# EAGLE design board (EAGLE 7.3.0)
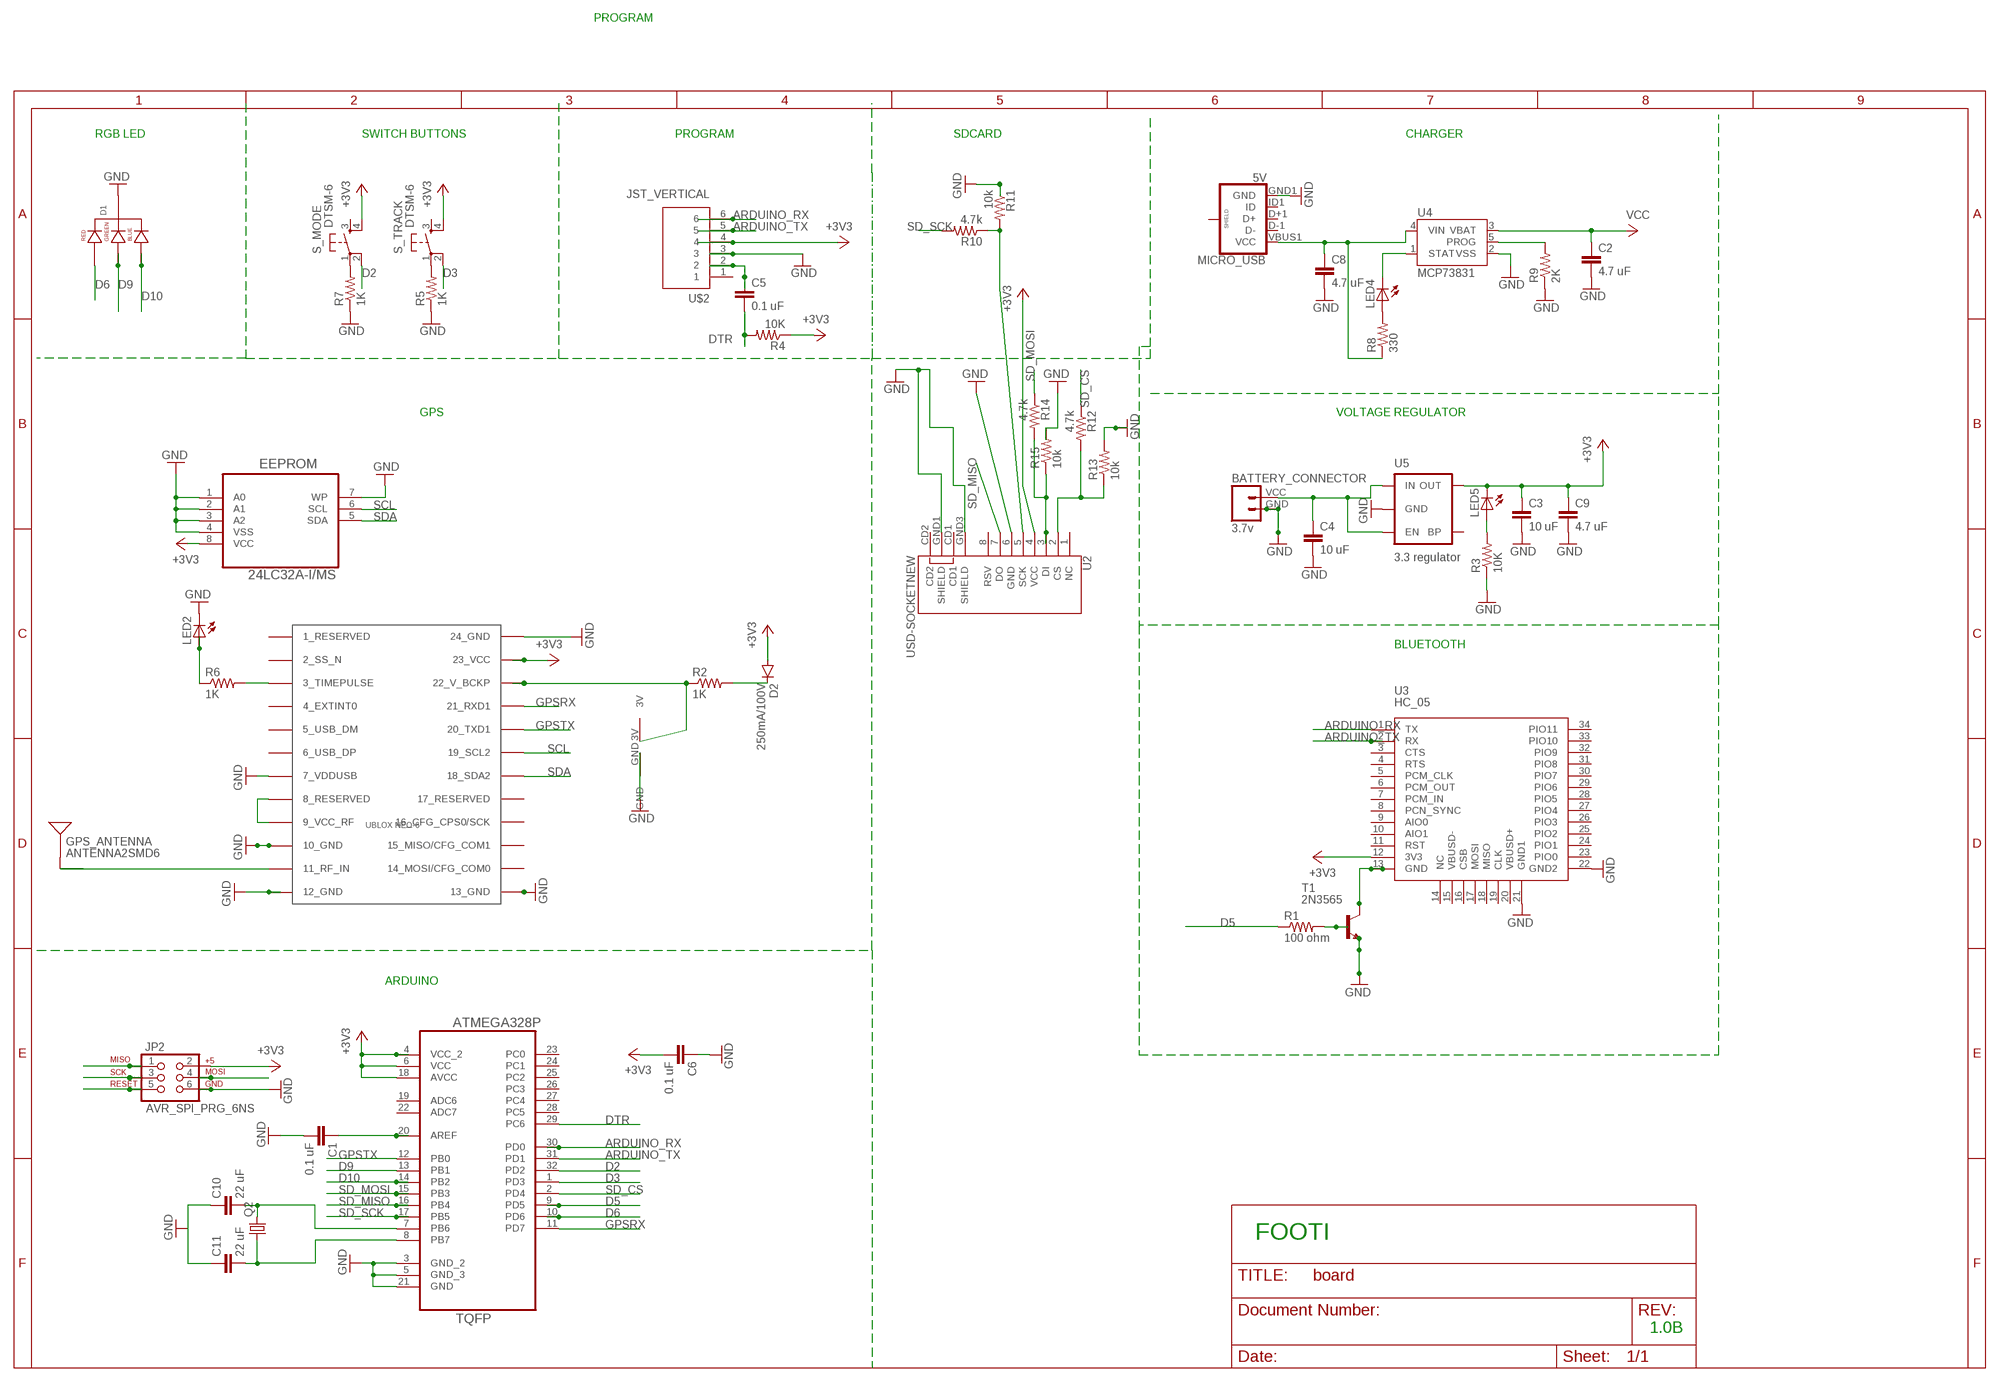
[diagram p0: schematic, sheet 1]

## Parts
BATTERY_CONNECTOR  3.7v  M024UCON-15767  [JST-2-SMD-VERT]
C1  0.1 uF  CAP1206  [1206]
C2  4.7 uF  CAP1206  [1206]
C3  10 uF  CAP1206  [1206]
C4  10 uF  CAP1206  [1206]
C5  0.1 uF  CAP1206  [1206]
C6  0.1 uF  CAP1206  [1206]
C8  4.7 uF  CAP1206  [1206]
C9  4.7 uF  CAP1206  [1206]
C10  22 uF  CAP1206  [1206]
C11  22 uF  CAP1206  [1206]
D1  LED-RGB-CC-THRUCLEAR  [LED-RGB-THRU]
D2  250mA/100V  DIODEBAS16  [SOD-323]
EEPROM  24LC32A-I/MS  [SOP65P490X110-8N]
GPS_ANTENNA  ANTENNA2SMD6  [ANTENNA-CHIP6]
JP2  AVR_SPI_PRG_6NS  [2X3-NS]
LED2  LED_E  [LED_1206]
LED4  LED_E  [LED_1206]
LED5  LED_E  [LED_1206]
MICRO_USB  5V  USB_MICROB_PLUGCONN-11752  [USB-B-MICRO-SMD_V03]
Q2  CRYSTALCTS406  [CTS406]
R1  100 ohm  RESISTOR1206  [1206]
R2  1K  RESISTOR1206  [1206]
R3  10K  RESISTOR1206  [1206]
R4  10K  RESISTOR1206  [1206]
R5  1K  RESISTOR1206  [1206]
R6  1K  RESISTOR1206  [1206]
R7  1K  RESISTOR1206  [1206]
R8  330  RESISTOR1206  [1206]
R9  2K  RESISTOR1206  [1206]
R10  4.7k  RESISTOR1206  [1206]
R11  10k  RESISTOR1206  [1206]
R12  4.7k  RESISTOR1206  [1206]
R13  10k  RESISTOR1206  [1206]
R14  4.7k  RESISTOR1206  [1206]
R15  10k  RESISTOR1206  [1206]
S_MODE  DTSM-6  [DTSM-6]
S_TRACK  DTSM-6  [DTSM-6]
T1  2N3565  [TO92]
U2  USD-SOCKETNEW  [MICRO-SD-SOCKET-PP]
U3  HC_05  [BLUETOOTH_SMD]
U4  MCP73831  [SOT23-5]
U5  3.3 regulator  MIC52053.3V  [SOT23-5]
U6  ATMEGA328P-AU  [QFP80P900X900X120-32N]
U$1  UBLOX_NEO-6  [UBLOX_NEO-6P]
U$2  JST_VERTICAL  [JST-6-SMD-VERT-1.0MM]
U$4  VL1220/HFN  VL1220  [VL1220]

## Nets
+3V3: C3.1 C6.2 C9.1 D2.A EEPROM.8(VCC) JP2.2 LED5.C R4.1 S_MODE.4 S_TRACK.4 U2.4(VCC) U3.12(3V3) U5.5(OUT) U6.4(VCC_2) U6.6(VCC) U6.18(AVCC) U$1.23_VCC U$2.4
ARDUINO_RX: U3.1(TX) U6.30(PD0) U$2.6
ARDUINO_TX: U3.2(RX) U6.31(PD1) U$2.5
D2: S_MODE.2 U6.32(PD2)
D3: S_TRACK.2 U6.1(PD3)
D5: R1.1 U6.9(PD5)
D6: D1.1(RED_CATHODE) U6.10(PD6)
D9: D1.3(GREEN_CATHODE) U6.13(PB1)
D10: D1.4(BLUE_CATHODE) U6.14(PB2)
DTR: C5.2 JP2.5 R4.2 U6.29(PC6)
GND [ground]: BATTERY_CONNECTOR.GND C1.2 C2.2 C3.2 C4.2 C6.1 C8.2 C9.2 C10.1 C11.1 D1.2(CATHODE) EEPROM.1(A0) EEPROM.2(A1) EEPROM.3(A2) EEPROM.4(VSS) EEPROM.7(WP) JP2.6 LED2.C MICRO_USB.GND1(GND) R3.1 R5.1 R7.1 R9.1 R11.1 R13.2 R15.2 T1.3(E) U2.6(GND) U2.GND1(SHIELD) U2.GND3(SHIELD) U3.21(GND1) U3.22(GND2) U4.2(VSS) U5.2(GND) U6.3(GND_2) U6.5(GND_3) U6.21(GND) U$1.7_VDDUSB U$1.10_GND U$1.12_GND U$1.13_GND U$1.24_GND U$2.3 U$4.GND
GPSRX: U6.11(PD7) U$1.21_RXD1
GPSTX: U6.12(PB0) U$1.20_TXD1
N$1: D2.C R2.2
N$2: C8.1 MICRO_USB.VBUS1(VCC) R8.1 U4.4(VIN)
N$3: R6.2 U$1.3_TIMEPULSE
N$4: LED2.A R6.1
N$5: U$1.8_RESERVED U$1.9_VCC_RF
N$6: R2.1 U$1.22_V_BCKP U$4.3V
N$7: GPS_ANTENNA.1(SIGNAL) U$1.11_RF_IN
N$8: LED4.A R8.2
N$9: R7.2 S_MODE.1
N$10: R5.2 S_TRACK.1
N$11: LED4.C U4.1(STAT)
N$13: C5.1 U$2.2
N$14: R10.1 R11.2 U2.5(SCK)
N$15: R9.2 U4.5(PROG)
N$16: LED5.A R3.2
N$17: R12.2 R13.1 U2.2(CS)
N$19: R1.2 T1.2(B)
N$20: T1.1(C) U3.13(GND)
N$22: C1.1 U6.20(AREF)
N$26: R14.2 R15.1 U2.3(DI)
N$27: C11.2 Q2.1 U6.8(PB7)
N$29: C10.2 Q2.3 U6.7(PB6)
SCL: EEPROM.6(SCL) U$1.19_SCL2
SD_CS: R12.1 U6.2(PD4)
SD_MISO: JP2.1 U2.7(DO) U6.16(PB4)
SD_MOSI: JP2.4 R14.1 U6.15(PB3)
SD_SCK: JP2.3 R10.2 U6.17(PB5)
SDA: EEPROM.5(SDA) U$1.18_SDA2
VCC: BATTERY_CONNECTOR.VCC C2.1 C4.1 U4.3(VBAT) U5.1(IN) U5.3(EN)
Unconnected: MICRO_USB.D+1(D+) MICRO_USB.D-1(D-) MICRO_USB.ID1(ID) MICRO_USB.SHIELD1(SHIELD) MICRO_USB.SHIELD2(SHIELD) MICRO_USB.SHIELD3(SHIELD) S_MODE.3 S_TRACK.3 U2.1(NC) U2.8(RSV) U2.CD1 U2.CD2 U3.3(CTS) U3.4(RTS) U3.5(PCM_CLK) U3.6(PCM_OUT) U3.7(PCM_IN) U3.8(PCN_SYNC) U3.9(AIO0) U3.10(AIO1) U3.11(RST) U3.14(NC) U3.15(VBUSD-) U3.16(CSB) U3.17(MOSI) U3.18(MISO) U3.19(CLK) U3.20(VBUSD+) U3.23(PIO0) U3.24(PIO1) U3.25(PIO2) U3.26(PIO3) U3.27(PIO4) U3.28(PIO5) U3.29(PIO6) U3.30(PIO7) U3.31(PIO8) U3.32(PIO9) U3.33(PIO10) U3.34(PIO11) U5.4(BP) U6.19(ADC6) U6.22(ADC7) U6.23(PC0) U6.24(PC1) U6.25(PC2) U6.26(PC3) U6.27(PC4) U6.28(PC5) U$1.1_RESERVED U$1.2_SS_N U$1.4_EXTINT0 U$1.5_USB_DM U$1.6_USB_DP U$1.14_MOSI/CFG_COM0 U$1.15_MISO/CFG_COM1 U$1.16_CFG_CPS0/SCK U$1.17_RESERVED U$2.1

## Notes on the sheet
- PROGRAM
- RGB LED | SWITCH BUTTONS | PROGRAM | SDCARD | CHARGER
- GPS | VOLTAGE REGULATOR
- BLUETOOTH
- ARDUINO
- FOOTI
- 1.0B

## Library data of the parts
BATTERY_CONNECTOR = SparkFun-Connectors:M02: Standard 2-pin 0.1" header. Use with - straight break away headers ( PRT-00116) - right angle break away headers (PRT-00553) - swiss pins (PRT-00743) - machine pins (PRT-00117) - female headers (PRT-00115) Molex polarized connector foot print use with: PRT-08233 with associated crimp pins and housings. 2.54_SCREWTERM for use with PRT-10571. 3.5mm Screw Terminal footprints for PRT-08084 5mm Screw Terminal footprints for use with PRT-08432
C1-C6 C8-C11 = SparkFun-Capacitors:CAP: Capacitor Standard 0603 ceramic capacitor, and 0.1" leaded capacitor.
D1 = SparkFun-LED:LED-RGB-CC-THRU: RGB Through-hole common cathode LED SparkFun Storefront: COM-00105 (Clear) COM-09264 (Diffuse); PROD_ID: DIO-08418
D2 = SparkFun-DiscreteSemi:DIODE: Diode These are standard reverse protection diodes and small signal diodes. SMA package can handle up to about 1A. SOD-323 can handle about 200mA. What the SOD-323 package when ordering, there are some mfgs out there that are 5-pin packages.; PROD_ID: DIO-09646
EEPROM = Microchip_By_element14_Batch_1:24LC32A-I/MS: IC, EEPROM, 32KBIT, SERIAL 400KHZ; MPN: 24LC32A-I/MS; OC_FARNELL: 1331330; OC_NEWARK: 69K7672; PACKAGE: 8MSOP; SUPPLIER: Microchip
GPS_ANTENNA = SparkFun-RF:ANTENNA2: Chip antenna Single endded antenna. Common with smaller chip antennas. CHIP4 package is the GPS Chip Antenna SKU: GPS-08418. CHIP5 package is 2.4GHz chip antenna SKU: WRL-00144.
JP2 = SparkFun-Connectors:AVR_SPI_PRG_6: AVR ISP 6 Pin This is the reduced ISP connector for AVR programming. Common on Arduino. This footprint will take up less PCB space and can be used with a 10-pin to 6-pin adapter such as SKU: BOB-08508 **Special note about "TEST_POINT" package. The stop mask is on the top side, so if you want your programming test points to be on the bottom of your board, make sure to place this package on the bottom side of the board. This also ensure that the orientation to program from the bottom side will be correct.
LED2 LED4 LED5 = eagle-ltspice:LED_E: LED Source: http://www.osram.convergy.de Source: www.luxeon.com Source: www.kingbright.com; SPICEMODEL: NONE; SPICEPREFIX: D; SPICETYPE: diode
MICRO_USB = SparkFun-Connectors:USB_MICROB_PLUG: USB Micro-B connectors Some male, some female. Watch your step!; PROD_ID: CONN-11752
Q2 = crystal:CRYSTAL: CRYSTAL; OC_FARNELL: unknown; OC_NEWARK: unknown
R1-R15 = SparkFun-Passives:RESISTOR: Resistor Basic schematic elements and footprints for 0603, 1206, and PTH resistors.
S_MODE S_TRACK = switch-tact:DTSM-6; OC_FARNELL: unknown
T1 = transistor:2N3565: NPN TRANSISTOR
U2 = SparkFun-Connectors:USD-SOCKET: microSD Socket Push-push type uSD socket. Schematic element and footprint production proven. Spark Fun Electronics SKU : PRT-00127. tDoc lines correctly indicate media card edge positions when inserting (unlocked, locked, depressed). NOTE: CD1 and CD2 are connected internally; PROD_ID: CONN-07820
U3 = SerialPortBluetooth:HC_05
U4 = SparkFun-PowerIC:MCP73831: Miniature single cell, fully integrated Li-Ion, Li-polymer charge management controller http://ww1.microchip.com/downloads/en/DeviceDoc/20001984g.pdf IC-09995; PROD_ID: IC-09995
U5 = SparkFun-PowerIC:MIC5205: MIC5205 150mA vreg 3.3V - VREG-00822 5V - VREG-00823; PROD_ID: VREG-00822
U6 = Ava:ATMEGA328P-AU; DESCRIPTION: 8-bit Microcontroller with In-System Programmable Flash; MPN: ATMEGA328P-AU; OC_FARNELL: 1715486; OC_NEWARK: 14R4631; PACKAGE: TQFP-32; SUPPLIER: Atmel
U$1 = Ava:UBLOX_NEO-6: UBLOX NEO-6 GPS MODULE Author Anthony Stirk / http://ava.upuaut.net http://www.u-blox.com/images/downloads/Product_Docs/LEA-6_NEO-6_MAX_HardwareIntegrationManual_%28GPS.G6-HW-09007%29.pdf http://www.u-blox.com/images/downloads/Product_Docs/NEO-6_DataSheet_%28GPS.G6-HW-09005%29.pdf
U$2 = SparkFun-Connectors:JST_VERTICAL; PROD_ID: CONN-08249
U$4 = footie:VL1220

## Net classes
1 ground: width 0.508 mm

## Board
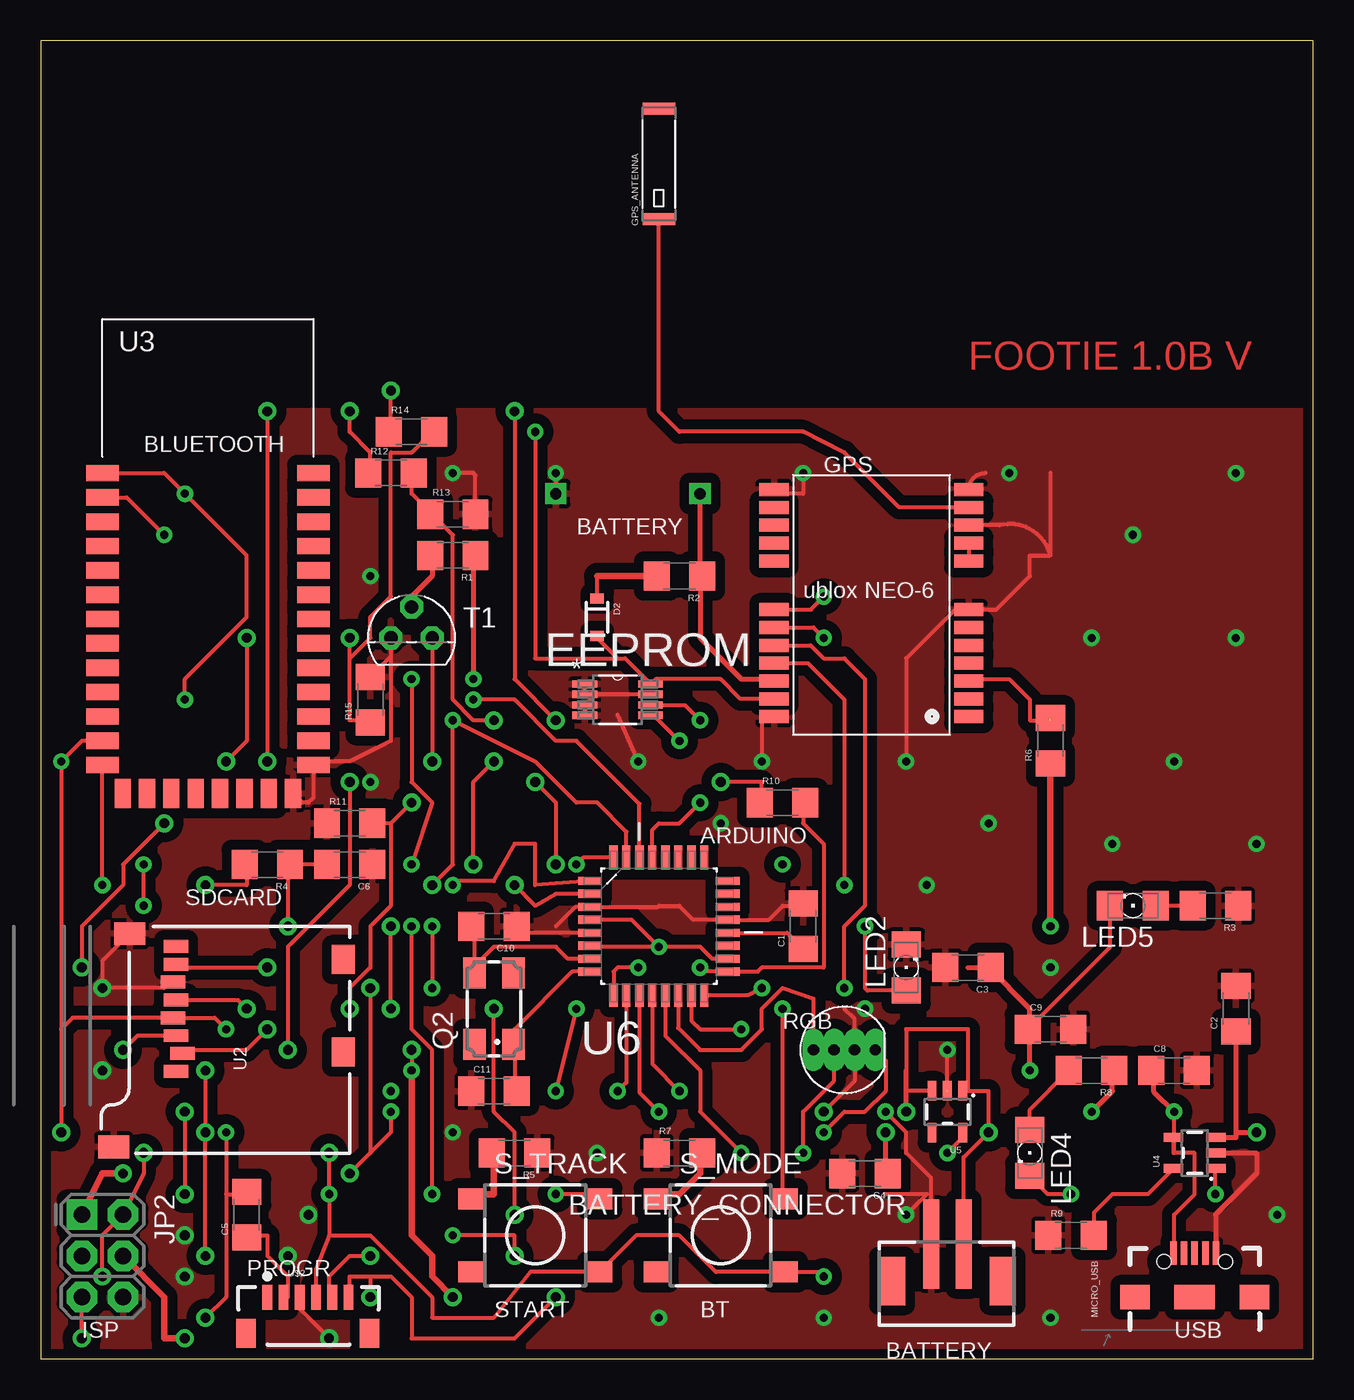
[diagram p1: board, top side]
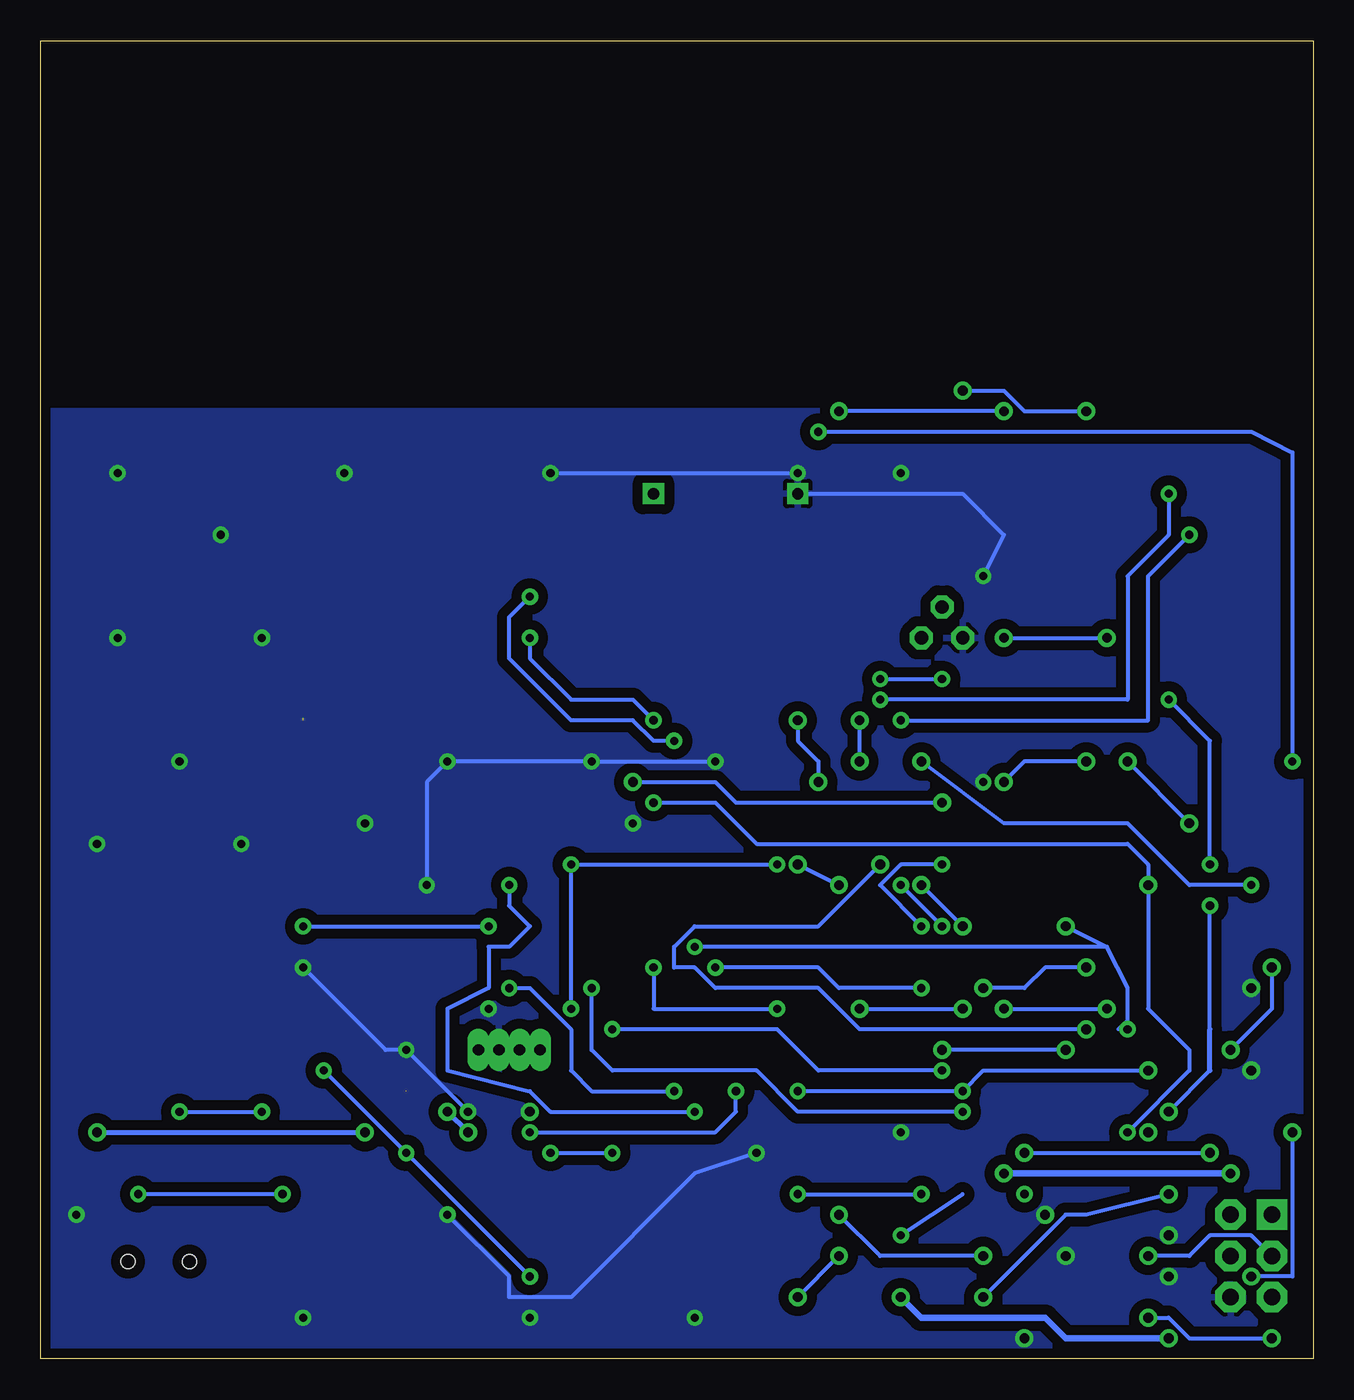
[diagram p2: board, bottom side, seen from below]

Size 78.41 x 81.27 mm. Coordinates in mm from the lower left corner, seen from the top.
Outline: 0,0 78.41,0 78.41,81.27 0,81.27 0,0
Copper layers (1*16): Top 0.035mm / dielectric 1.5mm / Bottom 0.035mm
Design rules "SparkFun": minimum track width 8mil, minimum drill 20mil, track to track 8mil, track to pad 8mil, pad to pad 8mil, via to via 8mil, smd to smd 8mil, copper to edge 8mil, drill to drill 8mil, minimum pad ring 12mil, minimum via ring 10mil, stop-mask expansion 4mil, vias tented up to drill 20mil, thermal gap 10mil

### Footprints (pad centres in the part's own frame; a part is rotated, then mirrored left to right if it is on the bottom)
JST-2-SMD-VERT = smd 1 x 5.5: GND 1,-2; VCC -1,-2 | smd 1.6 x 3: P$1 -3.4,0.27; P$2 3.4,0.27
1206 = smd 1.6 x 1.8: 1 -1.4,0; 2 1.4,0
LED-RGB-THRU = drill 0.7 pad 0.61 long: 1 1.905,0; 2 0.635,0; 3 -0.635,0; 4 -1.905,0
SOD-323 = smd 0.63 x 0.83: A 1.15,0; C -1.15,0
SOP65P490X110-8N = smd 1.524 x 0.457: 1 -2.032,0.965; 2 -2.032,0.33; 3 -2.032,-0.33; 4 -2.032,-0.965; 5 2.032,-0.965; 6 2.032,-0.33; 7 2.032,0.33; 8 2.032,0.965
ANTENNA-CHIP6 = smd 0.75 x 2: 1 -3.4,0; NC 3.4,0
2X3-NS = drill 1.016 pad 1.88 square: 1 -2.54,-1.27 | drill 1.016 pad 1.88 octagon: 2 -2.54,1.27; 3 0,-1.27; 4 0,1.27; 5 2.54,-1.27; 6 2.54,1.27
LED_1206 = smd 1.6 x 1.803: A -1.422,0; C 1.422,0
USB-B-MICRO-SMD_V03 = smd 1.45 x 0.4: D+1 2.725,0; D-1 2.725,0.65; GND1 2.725,-1.3; ID1 2.725,-0.65; VBUS1 2.725,1.3 | smd 1.5 x 1.8: SHIELD1 0,3.685; SHIELD2 0,-3.685 | smd 1.5 x 2.5: SHIELD3 0,0 | hole 0.85: 2.2,1.9; 2.2,-1.9
CTS406 = smd 1.9 x 1.4: 1 -2.2,-1.2; 2 2.2,-1.2; 3 2.2,1.2; 4 -2.2,1.2
DTSM-6 = smd 1.55 x 1.3: 1 -3.975,2.25; 2 3.975,2.25; 3 -3.975,-2.25; 4 3.975,-2.25
TO92 = drill 0.813 octagon: 1 1.27,0; 2 0,1.905; 3 -1.27,0
MICRO-SD-SOCKET-PP = smd 0.8 x 1.5: 1 -8.94,10.7; 2 -7.84,10.3; 3 -6.74,10.7; 4 -5.64,10.9; 5 -4.54,10.7; 6 -3.44,10.9; 7 -2.34,10.7; 8 -1.24,10.7 | smd 1.8 x 1.4: CD1 -2.05,0.4; CD2 -7.75,0.4 | smd 1.4 x 1.9: GND1 -13.6,14.55; GND3 -0.45,13.55
BLUETOOTH_SMD = smd 2 x 1: 1 0,0; 2 0,-1.5; 3 0,-3; 4 0,-4.5; 5 0,-6; 6 0,-7.5; 7 0,-9; 8 0,-10.5; 9 0,-12; 10 0,-13.5; 11 0,-15; 12 0,-16.5; 13 0,-18; 22 13,-18; 23 13,-16.5; 24 13,-15; 25 13,-13.5; 26 13,-12; 27 13,-10.5; 28 13,-9; 29 13,-7.5; 30 13,-6; 31 13,-4.5; 32 13,-3; 33 13,-1.5; 34 13,0 | smd 1 x 1.8: 14 1.25,-19.75; 15 2.75,-19.75; 16 4.25,-19.75; 17 5.75,-19.75; 18 7.25,-19.75; 19 8.75,-19.75; 20 10.25,-19.75; 21 11.75,-19.75
SOT23-5 = smd 0.55 x 1.2: 1 -0.95,-1.3; 2 0,-1.3; 3 0.95,-1.3; 4 0.95,1.3; 5 -0.95,1.3
QFP80P900X900X120-32N = smd 1.473 x 0.508: 1 -4.242,2.794; 2 -4.242,2.007; 3 -4.242,1.194; 4 -4.242,0.406; 5 -4.242,-0.406; 6 -4.242,-1.194; 7 -4.242,-2.007; 8 -4.242,-2.794; 17 4.242,-2.794; 18 4.242,-2.007; 19 4.242,-1.194; 20 4.242,-0.406; 21 4.242,0.406; 22 4.242,1.194; 23 4.242,2.007; 24 4.242,2.794 | smd 0.508 x 1.473: 9 -2.794,-4.242; 10 -2.007,-4.242; 11 -1.194,-4.242; 12 -0.406,-4.242; 13 0.406,-4.242; 14 1.194,-4.242; 15 2.007,-4.242; 16 2.794,-4.242; 25 2.794,4.242; 26 2.007,4.242; 27 1.194,4.242; 28 0.406,4.242; 29 -0.406,4.242; 30 -1.194,4.242; 31 -2.007,4.242; 32 -2.794,4.242
UBLOX_NEO-6P = smd 1.8 x 0.8: 1_RESERVED 6.4,-7.4; 2_SS_N 6.4,-6.3; 3_TIMEPULSE 6.4,-5.2; 4_EXTINT0 6.4,-4.1; 5_USB_DM 6.4,-3; 6_USB_DP 6.4,-1.9; 7_VDDUSB 6.4,-0.8; 8_RESERVED 6.4,2.2; 9_VCC_RF 6.4,3.3; 10_GND 6.4,4.4; 11_RF_IN 6.4,5.5; 12_GND 6.4,6.6; 13_GND -5.6,6.6; 14_MOSI/CFG_COM0 -5.6,5.5; 15_MISO/CFG_COM1 -5.6,4.4; 16_CFG_CPS0/SCK -5.6,3.3; 17_RESERVED -5.6,2.2; 18_SDA2 -5.6,-0.8; 19_SCL2 -5.6,-1.9; 20_TXD1 -5.6,-3; 21_RXD1 -5.6,-4.1; 22_V_BCKP -5.6,-5.2; 23_VCC -5.6,-6.3; 24_GND -5.6,-7.4
JST-6-SMD-VERT-1.0MM = smd 0.6 x 1.55: 1 -2.54,1.27; 2 -1.54,1.27; 3 -0.54,1.27; 4 0.46,1.27; 5 1.46,1.27; 6 2.46,1.27 | smd 1.2 x 1.8: P$1 -3.84,-0.955; P$2 3.76,-0.955
VL1220 = drill 0.7 pad 0.75 square: 3V 0,0; GND 8.89,0

### Placement (x,y rotation side)
BATTERY_CONNECTOR  55.88,5.08 180 top
C1  46.99,26.67 90 top
C2  73.66,21.59 90 top
C3  57.15,24.13 180 top
C4  50.8,11.43 180 top
C5  12.7,8.89 90 top
C6  19.05,30.48 180 top
C8  69.85,17.78 0 top
C9  62.23,20.32 0 top
C10  27.94,26.67 180 top
C11  27.94,16.51 0 top
D1  49.53,19.05 0 top
D2  34.29,45.72 270 top
EEPROM  35.56,40.64 0 top
GPS_ANTENNA  38.1,73.66 90 top
JP2  3.81,6.35 270 top
LED2  53.34,24.13 90 top
LED4  60.96,12.7 270 top
LED5  67.31,27.94 180 top
MICRO_USB  71.12,3.81 90 top
Q2  27.94,21.59 90 top
R1  25.4,49.53 180 top
R2  39.37,48.26 180 top
R3  72.39,27.94 180 top
R4  13.97,30.48 180 top
R5  29.21,12.7 180 top
R6  62.23,38.1 90 top
R7  39.37,12.7 0 top
R8  64.77,17.78 180 top
R9  63.5,7.62 0 top
R10  45.72,34.29 0 top
R11  19.05,33.02 0 top
R12  21.59,54.61 0 top
R13  25.4,52.07 0 top
R14  22.86,57.15 0 top
R15  20.32,40.64 90 top
S_MODE  41.91,7.62 0 top
S_TRACK  30.48,7.62 0 top
T1  22.86,44.45 0 top
U2  19.05,26.67 90 top
U3  3.81,54.61 0 top
U4  71.12,12.7 90 top
U5  55.88,15.24 180 top
U6  38.1,26.67 0 top
U$1  50.8,46.99 0 top
U$2  16.51,2.54 0 top
U$4  40.64,53.34 180 top

### Tracks (layer width: path | path; a pad name or v marks a point on that pad's centre or on a via)
+3V3  (via drill 0.5, 0.5 pad 0.25, 0.6)
  Top 0.254: 1.27,20.32 v1.27,36.83 2.54,38.1 U3.12 | 1.27,20.32 v1.27,13.97 | v30.48,57.15 30.48,43.18 35.56,43.18 | 35.56,43.18 36.02,43.18 EEPROM.8 37.9,41.91 41.91,41.91 43.13,40.69 U$1.23_VCC | v48.26,5.08 47.97,5.37 S_MODE.4 41.62,5.37 39.37,7.62 36.7,7.62 S_TRACK.4 30.19,5.37 27.94,2.54 24.13,2.54 24.13,3.81 20.32,7.62 17.78,7.62 | U5.5 56.83,13.65 v55.88,12.7 | D2.A 34.29,44.45 35.56,43.18 | LED5.C 65.89,25.38 C9.1 | v38.1,25.4 33.93,25.4 U6.6 | v38.1,25.4 36.42,27.08 U6.4 | U6.18 41.38,24.66 40.64,25.4 v38.1,25.4 | 17.78,7.62 v17.78,10.16 v17.78,12.7 | 17.78,7.62 16.97,5.54 U$2.4 | 1.27,20.32 1.98,21.03 U2.4 10.72,21.03 v11.43,20.32 | v3.81,5.08 3.81,7.62 JP2.2 6.35,11.43 v6.35,12.7 | 17.78,30.48 C6.2 R4.1 15.24,30.48 v15.24,26.67
  Top 0.305: v60.96,17.78 60.96,20.32 | 60.96,20.32 60.96,21.59 58.42,24.13 C3.1 57.15,24.13 | 60.96,20.32 C9.1
  Bottom 0.254: v11.43,20.32 11.99,20.32 11.43,20.88 11.43,22.86 12.7,25.4 | 12.7,25.4 v38.1,25.4 | v30.48,57.15 3.81,57.15 1.27,55.88 v1.27,36.83 | v48.26,5.08 v55.88,12.7 v60.96,17.78 | v3.81,5.08 1.27,5.08 v1.27,13.97 | v17.78,12.7 v6.35,12.7 | v15.24,26.67 12.7,25.4
ARDUINO_RX  (via drill 0.5, 0.6)
  Top 0.254: U3.1 7.62,54.61 v8.89,53.34 12.7,49.53 12.7,45.72 8.89,41.91 v8.89,40.64 | v26.67,40.64 29.21,40.64 31.75,38.1 33.02,38.1 36.91,34.21 U6.30 | v6.35,27.94 v6.35,30.48 | v25.4,7.62 29.21,7.62 v29.21,6.35 | v31.75,3.81 29.21,1.27 22.86,1.27 22.86,3.81 21.59,5.08 20.32,5.08 | 20.32,5.08 19.05,5.08 19.05,3.81 U$2.6 | v8.89,15.24 v8.89,10.16 | 20.32,5.08 v20.32,3.81
  Bottom 0.254: v8.89,53.34 8.89,50.8 11.43,48.26 11.43,40.64 v26.67,40.64 | v25.4,7.62 21.59,10.16 | 6.35,20.32 v6.35,27.94 | v6.35,30.48 6.35,38.1 v8.89,40.64 | v31.75,3.81 v29.21,6.35 | v20.32,3.81 15.24,8.89 13.97,8.89 v8.89,10.16 | 6.35,17.78 v8.89,15.24
  Bottom 0.305: 6.35,17.78 6.35,20.32
ARDUINO_TX  (via drill 0.5, 0.6)
  Top 0.254: U3.2 5.31,53.11 v7.62,50.8 | U6.31 36.09,32.49 34.29,34.29 33.02,34.29 30.5,36.8 v25.4,39.37 25.4,30.48 v24.13,29.21 | v21.59,21.59 v21.59,26.67 | v27.94,21.59 27.94,15.24 29.21,13.97 v29.21,8.89 | v20.32,6.35 19.05,6.35 17.78,5.08 17.78,3.81 U$2.5
  Bottom 0.254: v25.4,39.37 10.16,39.37 10.16,48.26 v7.62,50.8 | v21.59,26.67 v24.13,29.21 | v27.94,21.59 v21.59,21.59 | v29.21,8.89 26.67,6.35 v20.32,6.35
D2  (via drill 0.5)
  Top 0.254: v45.72,21.59 45.72,10.16 S_MODE.2 | U6.32 33.45,30.91 v33.02,30.48
  Bottom 0.254: v45.72,21.59 v45.72,30.48 v33.02,30.48
D3  (via drill 0.5)
  Top 0.254: v22.86,26.67 22.86,20.32 24.13,19.05 v24.13,10.16 | v31.75,10.16 34.29,10.16 S_TRACK.2 | U6.1 30.48,29.21 30.48,31.75 29.21,31.75 27.94,29.46 25.65,29.46 v25.4,29.21
  Bottom 0.254: v22.86,26.67 v25.4,29.21 | v31.75,10.16 v24.13,10.16
D5  (via drill 0.5)
  Top 0.254: v24.13,26.67 v24.13,22.86 | v22.86,41.91 22.86,35.56 24.13,34.29 v22.86,30.48 | v36.83,24.13 35.56,24.13 35.31,23.88 U6.9
  Top 0.305: v26.67,41.91 26.67,49.53 R1.1
  Bottom 0.254: v24.13,22.86 29.21,22.86 30.48,24.13 v36.83,24.13 | v24.13,26.67 26.67,29.21 25.4,30.48 v22.86,30.48 | v26.67,41.91 v22.86,41.91
D6  (via drill 0.5)
  Top 0.254: v48.26,13.97 49.53,15.24 50.8,15.24 52.07,16.51 52.07,18.41 D1.1 | U6.10 36.09,17.04 v35.56,16.51
  Bottom 0.254: v48.26,13.97 36.83,13.97 35.56,15.24 v35.56,16.51
D9  (via drill 0.5)
  Top 0.254: v43.18,12.7 40.64,15.24 40.64,17.78 38.51,19.91 U6.13 | v46.99,12.7 46.99,15.24 48.9,17.14 D1.3
  Bottom 0.254: v46.99,12.7 v43.18,12.7
D10
  Top 0.254: U6.14 39.29,20.4 40.64,19.05 43.18,19.05 44.45,20.32 44.45,21.59 45.72,22.86 47.62,22.23 D1.4
DTR  (via drill 0.5, 0.6)
  Top 0.254: U6.29 37.69,32.61 38.1,33.02 39.37,33.02 v40.64,34.29 | 11.43,10.16 12.7,10.16 C5.2 | v11.43,13.97 11.43,10.16 | v2.54,1.27 JP2.5 | v10.16,2.54 11.43,3.81 11.43,10.16 | v10.16,29.21 12.7,29.21 12.7,30.48 R4.2
  Bottom 0.254: v40.64,34.29 36.83,34.29 34.29,31.75 11.43,31.75 10.16,30.48 v10.16,29.21 10.16,21.59 7.62,19.05 7.62,17.78 v11.43,13.97 | v2.54,1.27 7.62,1.27 8.89,2.54 v10.16,2.54
GND  (via drill 0.5, 0.5 pad 0.25, 0.6)  (1 unrouted)
  Top 0.254: 55.88,16.51 v55.88,19.05 | 72.39,12.7 74.93,12.7 | 62.23,49.53 60.96,49.53 60.96,48.26 58.89,46.19 U$1.7_VDDUSB 56.35,46.19 53.34,43.18 v53.34,36.83 | 62.23,49.53 arc90 59.1,51.39 U$1.10_GND | U$1.12_GND arc-90 58.22,54.61 | 62.23,54.61 62.23,49.53 | v46.99,54.61 46.99,53.34 45.72,53.34 | v31.75,54.61 U$4.GND | EEPROM.7 34.19,40.97 34.07,40.86 | 34.07,40.86 EEPROM.3 EEPROM.4 | EEPROM.1 EEPROM.2 33.96,40.97 34.07,40.86 | v44.45,36.83 44.45,39.37 U$1.24_GND | v36.83,36.83 35.56,39.7 | U3.21 16.13,34.29 16.51,34.29 16.81,34.59 U3.22 17.03,36.83 19.05,36.83 21.59,38.1 T1.3 21.59,43.31 R15.2 | BATTERY_CONNECTOR.GND 54.88,11.16 53.34,12.7 53.34,13.97 v52.07,15.24 | v53.34,8.89 54.61,10.16 52.07,10.16 | 49.53,21.59 50.16,20.95 D1.2 50.16,17.14 v48.26,15.24 | U6.5 29.75,26.26 C10.1 | 31.75,26.67 32.94,27.86 U6.3 38.02,27.86 38.1,27.94 39.37,27.94 40.23,27.08 U6.21 44.86,27.08 45.72,27.94 46.86,27.94 C1.2 | U$2.3 15.97,3.08 v17.78,1.27 | U2.6 7.99,23.23 7.62,22.86 v3.81,22.86 3.81,24.53 U2.GND3 | R13.2 26.8,54.48 26.67,54.61 v25.4,54.61
  Top 0.305: 72.39,12.7 U4.2 74.93,12.7 74.93,11.43 72.39,8.89 72.42,8.89 MICRO_USB.GND1
  Bottom 0.254: v46.99,54.61 v31.75,54.61 | v36.83,36.83 v44.45,36.83 v53.34,36.83 54.61,35.56 v54.61,29.21 | U$4.GND 21.59,53.34 19.05,50.8 v20.32,48.26 | v52.07,15.24 v55.88,19.05 57.15,19.05 v62.23,24.13 | v34.29,12.7 38.1,11.43 45.72,3.81 49.53,3.81 49.53,5.08 v53.34,8.89
  other vias: 59.69,54.61 8.89,5.08 67.31,50.8 69.85,36.83 62.23,2.54 48.26,2.54 38.1,2.54 73.66,44.45 73.66,54.61 64.77,44.45 20.32,35.56 58.42,33.02 74.93,31.75 66.04,31.75 76.2,8.89 50.8,21.59 3.81,17.78 25.4,13.97 15.24,6.35 16.51,8.89 8.89,7.62 41.91,33.02
  pour Top (isolate 0.61): 0,58.42 78.74,58.42 78.74,-1.27 0,-1.27
  pour Bottom (isolate 0.61): 0,58.42 78.74,58.42 78.74,-1.27 0,-1.27
GPSRX  (via drill 0.5)
  Top 0.254: U$1.21_RXD1 47.28,42.89 49.53,40.64 v49.53,29.21 | U6.11 36.91,16.43 v38.1,15.24
  Bottom 0.254: v49.53,29.21 49.53,27.94 48.26,26.67 49.53,25.4 50.8,25.4 50.8,22.86 53.34,21.59 53.34,17.78 48.26,16.51 46.99,15.24 v38.1,15.24
GPSTX  (via drill 0.5)
  Top 0.254: U$1.20_TXD1 47.45,43.99 48.26,43.18 49.53,43.18 50.8,41.91 50.8,27.94 49.53,26.67 v49.53,22.86 | U6.12 37.69,18.19 v39.37,16.51
  Bottom 0.254: v49.53,22.86 48.26,22.86 45.72,20.32 45.72,17.78 44.45,16.51 v39.37,16.51
N$1
  Top 0.254: D2.C 34.29,48.26
  Top 0.406: R2.2 34.29,48.26
N$2  (via drill 0.5 pad 0.25)
  Top 0.254: MICRO_USB.VBUS1 69.85,7.8 69.85,8.89 71.12,10.16 71.12,12.7 69.85,12.7 | 69.85,12.7 69.82,12.7 U4.4 | 69.85,12.7 v69.85,15.24
  Top 0.305: v64.77,15.24 66.04,16.51 66.04,17.78 R8.1 | v69.85,15.24 68.58,16.51 68.58,17.78 C8.1
  Bottom 0.254: v69.85,15.24 v64.77,15.24
N$3  (1 unrouted)
  Top 0.254: 62.23,39.37 60.96,39.37 60.96,40.64 59.69,41.91 57.15,41.91 U$1.3_TIMEPULSE
N$4  (via drill 0.5)
  Top 0.254: v50.8,26.67 50.8,22.86 50.95,22.71 LED2.A
  Top 0.406: R6.1 v62.23,26.67
  Bottom 0.254: v62.23,26.67 v50.8,26.67
N$5
  Top 0.254: U$1.9_VCC_RF U$1.8_RESERVED
N$6
  Top 0.305: 40.64,48.26 U$4.3V | 40.64,48.26 40.64,44.45 43.18,41.91 44.45,41.91 U$1.22_V_BCKP | 40.64,48.26 R2.1
N$7
  Top 0.254: U$1.11_RF_IN 52.92,52.49 49.53,55.88 46.99,57.15 39.37,57.15 38.1,58.42 GPS_ANTENNA.1
N$8
  Top 0.254: LED4.A 60.96,15.37 R8.2
N$9
  Top 0.406: R7.2 40.64,12.7 40.64,11.43 39.37,10.16 38.1,10.16 S_MODE.1
N$10
  Top 0.406: R5.2 27.94,12.7 27.94,10.16 26.67,10.16 S_TRACK.1
N$11  (via drill 0.5 pad 0.25)
  Top 0.254: v72.39,10.16 72.39,11.72 U4.1 | v63.5,10.16 62.08,10.16 LED4.C
  Bottom 0.254: v63.5,10.16 v72.39,10.16
N$13
  Top 0.254: U$2.2 15.24,3.81 15.24,5.08 13.97,6.35 13.97,7.62 12.7,7.62 C5.1
N$14  (via drill 0.6)
  Top 0.254: 21.59,33.02 R11.2 20.32,33.02 | v22.86,34.29 21.59,33.02 | v41.91,35.56 44.45,35.56 44.45,34.29 R10.1 | v19.05,21.59 19.05,22.86 20.32,24.13 20.32,26.67 21.59,27.94 21.59,33.02 | U2.5 12.16,22.13 v12.7,21.59
  Bottom 0.254: v22.86,34.29 35.56,34.29 36.83,35.56 v41.91,35.56 | v19.05,21.59 v12.7,21.59
N$15
  Top 0.254: U4.5 68.23,10.16 66.04,10.16 64.9,9.02 R9.2
N$16
  Top 0.254: 68.73,27.79 LED5.A R3.2
N$17  (via drill 0.6)
  Top 0.254: 24.13,52.07 25.4,50.8 25.4,40.64 26.67,39.37 v27.94,39.37 | v27.94,36.83 26.67,35.56 v26.67,30.48 | v13.97,20.32 12.7,19.05 8.89,19.05 U2.2 | 24.13,52.07 22.86,53.34 22.86,54.61 R12.2 | 24.13,52.07 R13.1
  Bottom 0.254: v27.94,36.83 v27.94,39.37 | v26.67,30.48 30.48,26.67 38.1,26.67 39.37,25.4 39.37,24.13 38.1,24.13 36.83,22.86 30.48,22.86 27.94,20.32 v13.97,20.32
N$19
  Top 0.305: T1.2 22.86,46.99 24.13,48.26 24.13,49.53 R1.2
N$20  (via drill 0.5 pad 0.25, 0.6)
  Top 0.254: v3.81,29.21 U3.13 3.81,36.83 | T1.1 v24.13,36.83
  Bottom 0.254: v24.13,36.83 19.05,33.02 11.43,33.02 7.62,29.21 v3.81,29.21
N$22
  Top 0.254: U6.20 46,26.26 C1.1
N$26  (via drill 0.6)
  Top 0.254: 19.05,43.18 20.32,44.45 20.32,45.72 21.59,46.99 21.59,55.88 22.86,55.88 24.13,57.15 R14.2 | 19.05,43.18 19.05,39.37 20.32,39.37 R15.1 | v2.54,24.13 2.54,26.67 5.08,29.21 5.08,30.48 v7.62,33.02 | v11.43,36.83 12.7,38.1 v12.7,44.45 | 19.05,43.18 v19.05,44.45 | U2.3 5.96,19.93 v5.08,19.05
  Bottom 0.254: v5.08,19.05 2.54,21.59 v2.54,24.13 | v11.43,36.83 v7.62,33.02 | v19.05,44.45 v12.7,44.45
N$27
  Top 0.254: U6.8 32.77,23.88 29.21,20.32 29.21,19.46 | 29.21,19.46 29.21,16.64 C11.2 | 29.21,19.46 Q2.1
N$29
  Top 0.254: U6.7 32.49,24.66 31.75,25.4 27.94,25.4 26.67,24.13 26.67,23.86 Q2.3 26.74,26.47 C10.2
SCL  (via drill 0.5)
  Top 0.254: EEPROM.6 39.7,40.31 v40.64,39.37 | U$1.19_SCL2 47.62,45.09 v48.26,44.45
  Bottom 0.254: v48.26,44.45 48.26,43.18 45.72,40.64 41.91,40.64 v40.64,39.37
SD_CS  (via drill 0.6)
  Top 0.254: v31.75,30.48 31.75,34.29 v30.48,35.56 | v31.75,39.37 29.21,41.91 v29.21,58.42 | v19.05,58.42 19.05,57.15 20.32,55.88 20.32,54.61 R12.1 | U6.2 31.75,28.68 30.48,27.94 v29.21,29.21
  Bottom 0.254: v31.75,30.48 v29.21,29.21 | v30.48,35.56 30.48,36.83 31.75,38.1 v31.75,39.37 | v19.05,58.42 v29.21,58.42
SD_MISO  (via drill 0.5, 0.6)
  Top 0.254: U6.16 43.61,22.43 v44.45,22.86 | 20.32,12.7 v19.05,11.43 | v20.32,22.86 20.32,12.7 | v13.97,24.13 8.89,24.13 U2.7 | v21.59,15.24 21.59,13.97 20.32,12.7
  Top 0.406: JP2.1 3.81,11.43 v5.08,11.43
  Bottom 0.254: v21.59,15.24 31.75,15.24 34.29,17.78 43.18,17.78 44.45,19.05 v44.45,22.86 | v13.97,24.13 16.51,24.13 17.78,22.86 v20.32,22.86
  Bottom 0.406: v19.05,11.43 v5.08,11.43
SD_MOSI  (via drill 0.5, 0.6)
  Top 0.254: U6.15 40.11,20.85 40.64,20.32 v43.18,20.32 | v22.86,19.05 v22.86,17.78 | v15.24,19.05 15.24,25.4 19.05,29.21 v19.05,35.56 | v13.97,58.42 v13.97,36.83 | v21.59,59.69 21.59,57.15 R14.1
  Top 0.406: v8.89,1.27 7.62,1.27 7.62,3.81 JP2.4 | v25.4,3.81 24.13,5.08 24.13,6.35 22.86,7.62 v22.86,17.78
  Bottom 0.254: v22.86,17.78 30.48,17.78 33.02,20.32 v43.18,20.32 | v15.24,19.05 v22.86,19.05 | v19.05,35.56 17.78,36.83 v13.97,36.83 | v13.97,58.42 17.78,58.42 19.05,59.69 v21.59,59.69
  Bottom 0.406: v8.89,1.27 15.24,1.27 16.51,2.54 24.13,2.54 v25.4,3.81
SD_SCK  (via drill 0.5, 0.6)
  Top 0.254: v33.02,21.59 v31.75,16.51 | v10.16,17.78 v10.16,13.97 v10.16,6.35 | v40.64,24.13 40.89,23.88 U6.17 44.2,23.88 44.45,24.13 48.26,24.13 48.26,31.75 46.99,33.02 46.99,34.29 R10.2
  Bottom 0.254: v31.75,16.51 v21.59,16.51 20.32,17.78 v10.16,17.78 | v40.64,24.13 40.64,21.59 v33.02,21.59 | v10.16,6.35 7.62,6.35 6.35,7.62 3.81,7.62 JP2.3
SDA  (via drill 0.5)
  Top 0.254: U$1.18_SDA2 47.46,46.19 v48.26,46.99 | EEPROM.5 37.8,39.67 v39.37,38.1
  Bottom 0.254: v39.37,38.1 40.64,38.1 41.91,39.37 45.72,39.37 49.53,43.18 49.53,45.72 v48.26,46.99
VCC  (via drill 0.6)
  Top 0.254: BATTERY_CONNECTOR.VCC 56.88,12.43 v58.42,13.97 58.42,16.51 57.15,16.51 | 57.15,16.51 56.86,16.51 U5.1 | 57.15,16.51 57.15,20.32 53.34,20.32 53.34,17.78 | U5.3 53.37,16.54 53.34,16.51
  Top 0.305: U4.3 73.66,13.65 73.66,13.97 | 73.66,13.97 C2.1 73.66,20.32 | v53.34,15.24 53.34,16.51 53.34,17.78 | v52.07,13.97 52.07,11.43 C4.1 | 73.66,13.97 v74.93,13.97
  Bottom 0.305: v52.07,13.97 v53.34,15.24 | v74.93,13.97 v58.42,13.97

### Text on the board
Top: FOOTIE 1.0B V
tPlace: BLUETOOTH | GPS | BATTERY | ARDUINO | SDCARD | RGB | PROGR | START | BT | ISP | USB | BATTERY